# EAGLE board snesram (EAGLE 5.04), part 1 of 2
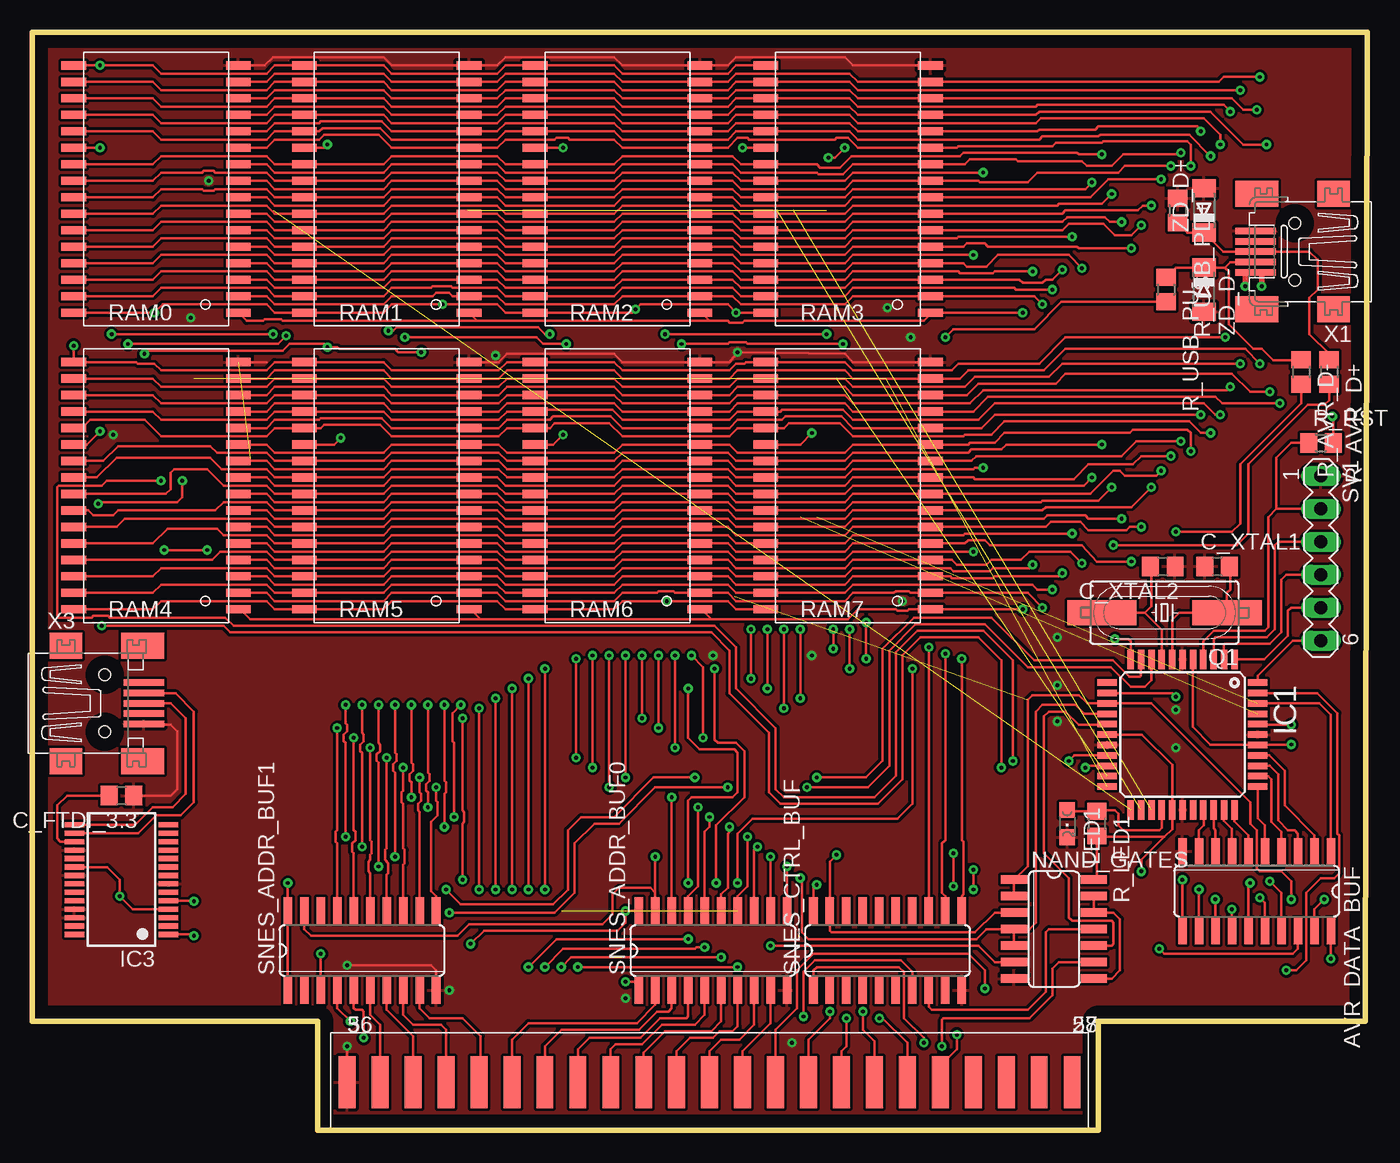
[diagram p2: board, top side]
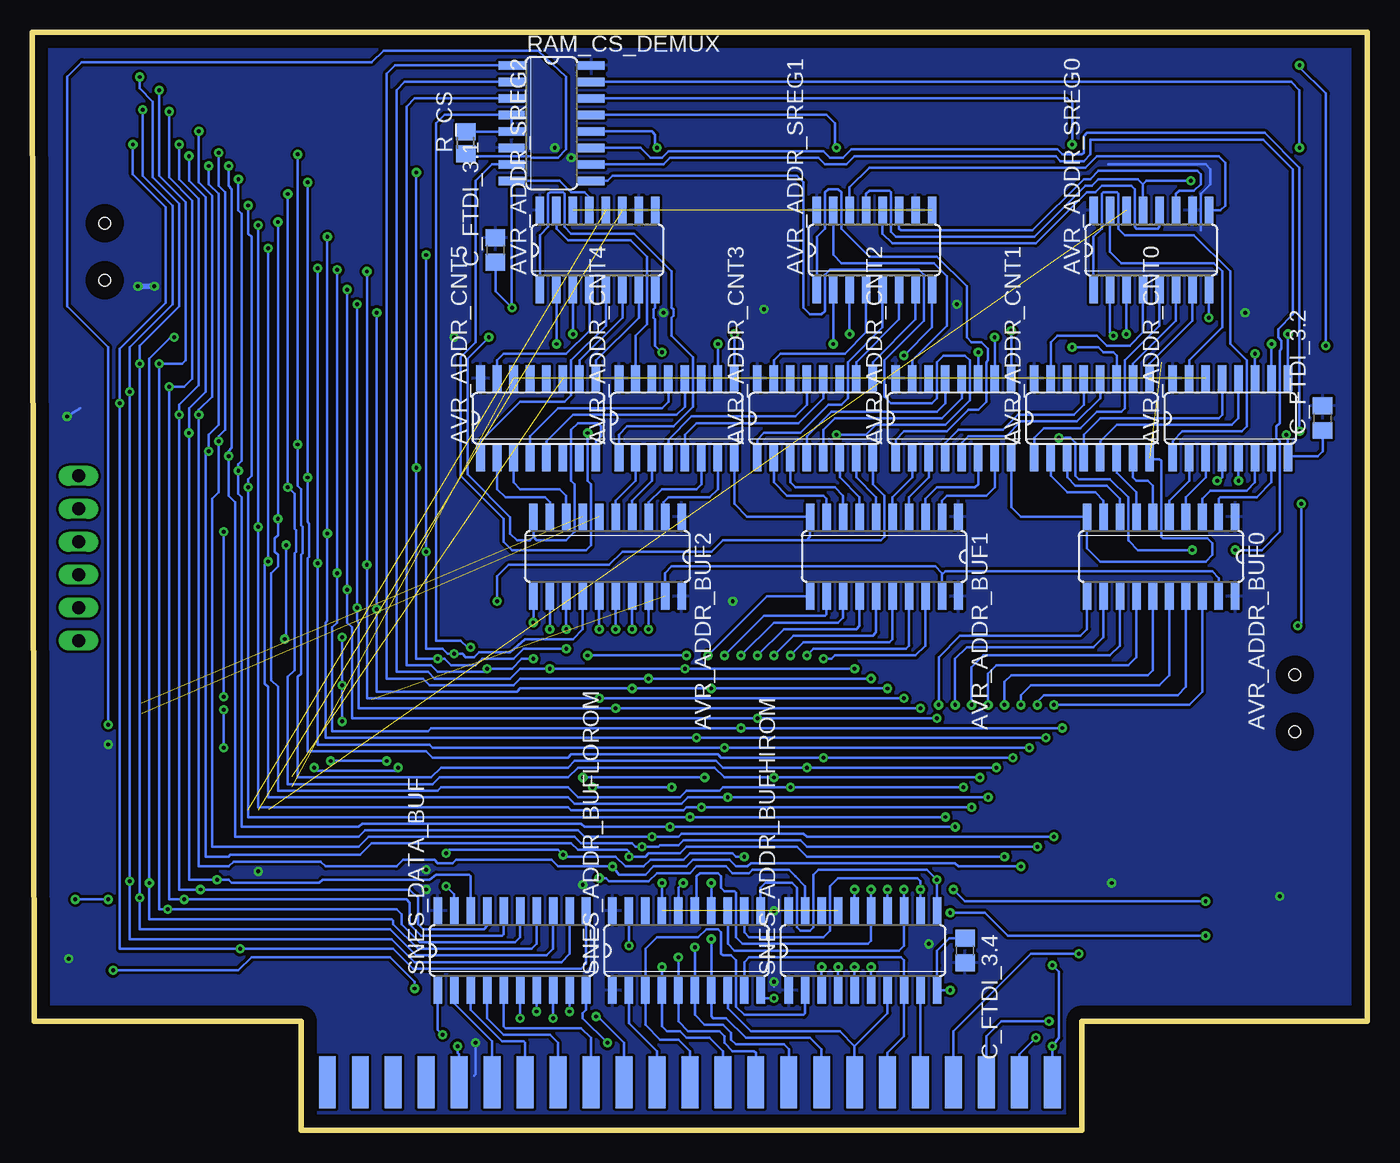
[diagram p3: board, bottom side, seen from below]

Size 102.87 x 84.58 mm. Coordinates in mm from the lower left corner, seen from the top.
Outline: 102.74,8.38 102.87,84.58 0,84.58 0,8.38 21.97,8.38 21.97,0 82.17,0 82.17,8.38 102.74,8.38
Copper layers (1*16): Top 0.035mm / dielectric 1.5mm / Bottom 0.035mm
Design rules "default *": minimum track width 0.2mm, minimum drill 0.3mm, track to track 8mil, track to pad 8mil, pad to pad 8mil, via to via 8mil, smd to smd 8mil, copper to edge 40mil, drill to drill 8mil, minimum pad ring 10mil, minimum via ring 8mil, stop-mask expansion 4mil, vias tented up to drill 0mil, thermal gap 10mil

## Footprints (pad centres in the part's own frame; a part is rotated, then mirrored left to right if it is on the bottom)
SO20 = smd 0.66 x 2.032: 1 -5.715,-3.073; 2 -4.445,-3.073; 3 -3.175,-3.073; 4 -1.905,-3.073; 5 -0.635,-3.073; 6 0.635,-3.073; 7 1.905,-3.073; 8 3.175,-3.073; 9 4.445,-3.073; 10 5.715,-3.073; 11 5.715,3.073; 12 4.445,3.073; 13 3.175,3.073; 14 1.905,3.073; 15 0.635,3.073; 16 -0.635,3.073; 17 -1.905,3.073; 18 -3.175,3.073; 19 -4.445,3.073; 20 -5.715,3.073
SO16 = smd 0.66 x 2.032: 1 -4.445,-3.073; 2 -3.175,-3.073; 3 -1.905,-3.073; 4 -0.635,-3.073; 5 0.635,-3.073; 6 1.905,-3.073; 7 3.175,-3.073; 8 4.445,-3.073; 9 4.445,3.073; 10 3.175,3.073; 11 1.905,3.073; 12 0.635,3.073; 13 -0.635,3.073; 14 -1.905,3.073; 15 -3.175,3.073; 16 -4.445,3.073
C0805 = smd 1.3 x 1.5: 1 -0.95,0; 2 0.95,0
TQFP44 = smd 1.5 x 0.5: 1 -5.8,4; 2 -5.8,3.2; 3 -5.8,2.4; 4 -5.8,1.6; 5 -5.8,0.8; 6 -5.8,0; 7 -5.8,-0.8; 8 -5.8,-1.6; 9 -5.8,-2.4; 10 -5.8,-3.2; 11 -5.8,-4; 23 5.8,-4; 24 5.8,-3.2; 25 5.8,-2.4; 26 5.8,-1.6; 27 5.8,-0.8; 28 5.8,0; 29 5.8,0.8; 30 5.8,1.6; 31 5.8,2.4; 32 5.8,3.2; 33 5.8,4 | smd 0.5 x 1.5: 12 -4,-5.8; 13 -3.2,-5.8; 14 -2.4,-5.8; 15 -1.6,-5.8; 16 -0.8,-5.8; 17 0,-5.8; 18 0.8,-5.8; 19 1.6,-5.8; 20 2.4,-5.8; 21 3.2,-5.8; 22 4,-5.8; 34 4,5.8; 35 3.2,5.8; 36 2.4,5.8; 37 1.6,5.8; 38 0.8,5.8; 39 0,5.8; 40 -0.8,5.8; 41 -1.6,5.8; 42 -2.4,5.8; 43 -3.2,5.8; 44 -4,5.8
SSOP28 = smd 0.4 x 1.5: 1 -4.225,-3.625; 2 -3.575,-3.625; 3 -2.925,-3.625; 4 -2.275,-3.625; 5 -1.625,-3.625; 6 -0.975,-3.625; 7 -0.325,-3.625; 8 0.325,-3.625; 9 0.975,-3.625; 10 1.625,-3.625; 11 2.275,-3.625; 12 2.925,-3.625; 13 3.575,-3.625; 14 4.225,-3.625; 15 4.225,3.625; 16 3.575,3.625; 17 2.925,3.625; 18 2.275,3.625; 19 1.625,3.625; 20 0.975,3.625; 21 0.325,3.625; 22 -0.325,3.625; 23 -0.975,3.625; 24 -1.625,3.625; 25 -2.275,3.625; 26 -2.925,3.625; 27 -3.575,3.625; 28 -4.225,3.625
CHIPLED_0805 = smd 1.2 x 1.2: A 0,-1.05; C 0,1.05
SO14 = smd 0.66 x 2.032: 1 -3.81,-3.073; 2 -2.54,-3.073; 3 -1.27,-3.073; 4 0,-3.073; 5 1.27,-3.073; 6 2.54,-3.073; 7 3.81,-3.073; 8 3.81,3.073; 9 2.54,3.073; 10 1.27,3.073; 11 0,3.073; 12 -1.27,3.073; 13 -2.54,3.073; 14 -3.81,3.073
HC49UP = smd 5.334 x 1.93: 1 -4.826,0; 2 4.826,0
R0805 = smd 1.3 x 1.5: 1 -0.95,0; 2 0.95,0
R0805' = smd 1.3 x 1.5: 1 -0.85,0; 2 0.85,0
SOP-32 = smd 1.905 x 0.635: 1 -6.35,9.525; 2 -6.35,8.255; 3 -6.35,6.985; 4 -6.35,5.715; 5 -6.35,4.445; 6 -6.35,3.175; 7 -6.35,1.905; 8 -6.35,0.635; 9 -6.35,-0.635; 10 -6.35,-1.905; 11 -6.35,-3.175; 12 -6.35,-4.445; 13 -6.35,-5.715; 14 -6.35,-6.985; 15 -6.35,-8.255; 16 -6.35,-9.525; 17 6.35,-9.525; 18 6.35,-8.255; 19 6.35,-6.985; 20 6.35,-5.715; 21 6.35,-4.445; 22 6.35,-3.175; 23 6.35,-1.905; 24 6.35,-0.635; 25 6.35,0.635; 26 6.35,1.905; 27 6.35,3.175; 28 6.35,4.445; 29 6.35,5.715; 30 6.35,6.985; 31 6.35,8.255; 32 6.35,9.525
MA06-1 = drill 1.016 long: 1 -6.35,0; 2 -3.81,0; 3 -1.27,0; 4 1.27,0; 5 3.81,0; 6 6.35,0
1X31_SNES_HEADER = smd 1.3 x 4: P5 -27.94,0; P6 -25.4,0; P7 -22.86,0; P8 -20.32,0; P9 -17.78,0; P10 -15.24,0; P11 -12.7,0; P12 -10.16,0; P13 -7.62,0; P14 -5.08,0; P15 -2.54,0; P16 0,0; P17 2.54,0; P18 5.08,0; P19 7.62,0; P20 10.16,0; P21 12.7,0; P22 15.24,0; P23 17.78,0; P24 20.32,0; P25 22.86,0; P26 25.4,0; P27 27.94,0
1X31_SNES_HEADERBACK = smd 1.3 x 4 bottom: 36 -27.94,0; 37 -25.4,0; 38 -22.86,0; 39 -20.32,0; 40 -17.78,0; 41 -15.24,0; 42 -12.7,0; 43 -10.16,0; 44 -7.62,0; 45 -5.08,0; 46 -2.54,0; 47 0,0; 48 2.54,0; 49 5.08,0; 50 7.62,0; 51 10.16,0; 52 12.7,0; 53 15.24,0; 54 17.78,0; 55 20.32,0; 56 22.86,0; 57 25.4,0; 58 27.94,0
32005-201 = smd 3.1 x 0.5: 1 3,1.6; 2 3,0.8; 3 3,0; 4 3,-0.8; 5 3,-1.6 | smd 2.5 x 2: M1 -3,-4.45; M2 -3,4.45 | smd 3.3 x 2: M3 2.9,4.45; M4 2.9,-4.45 | hole 0.9: 0,2.2; 0,-2.2
32005-301 = smd 3.1 x 0.5: 1 3,1.6; 2 3,0.8; 3 3,0; 4 3,-0.8; 5 3,-1.6 | smd 2.5 x 2: M1 -3,-4.45; M2 -3,4.45 | smd 3.3 x 2: M3 2.9,4.45; M4 2.9,-4.45 | hole 0.9: 0,2.2; 0,-2.2
MINIMELF = smd 1.4 x 1.8: A 1.7,0; C -1.7,0

## Placement (x,y rotation side)
AVR_ADDR_BUF0  74245  [SO20]  15.87,44.2 180 bottom
AVR_ADDR_BUF1  74245  [SO20]  37.21,44.2 180 bottom
AVR_ADDR_BUF2  74245  [SO20]  58.55,44.2 180 bottom
AVR_ADDR_CNT0  40193D  [SO16]  10.54,54.86 0 bottom
AVR_ADDR_CNT1  40193D  [SO16]  21.21,54.86 0 bottom
AVR_ADDR_CNT2  40193D  [SO16]  31.88,54.86 0 bottom
AVR_ADDR_CNT3  40193D  [SO16]  42.54,54.86 0 bottom
AVR_ADDR_CNT4  40193D  [SO16]  53.21,54.86 0 bottom
AVR_ADDR_CNT5  40193D  [SO16]  63.88,54.86 0 bottom
AVR_ADDR_SREG0  74HCT595D  [SO16]  16.64,67.82 0 bottom
AVR_ADDR_SREG1  74HCT595D  [SO16]  37.97,67.82 0 bottom
AVR_ADDR_SREG2  74HCT595D  [SO16]  59.31,67.82 0 bottom
AVR_DATA_BUF  74245  [SO20]  94.36,18.41 180 top
C_FTDI_3.1  100n  [C0805]  67.18,67.82 90 bottom
C_FTDI_3.2  100n  [C0805]  3.43,54.86 90 bottom
C_FTDI_3.3  100n  [C0805]  6.86,25.78 180 top
C_FTDI_3.4  100n  [C0805]  30.99,13.84 270 bottom
C_XTAL1  22p  [C0805]  91.31,43.43 0 top
C_XTAL2  22p  [C0805]  87.12,43.43 180 top
IC1  ATMEGA644A  [TQFP44]  88.65,30.48 270 top
IC3  FT232RL  [SSOP28]  6.86,19.3 90 top
LED1  [CHIPLED_0805]  79.76,23.62 180 top
NAND_GATES  74S00D  [SO14]  78.74,15.49 270 top
Q1  [HC49UP]  87.25,39.88 180 top
R_AVR_D+  68  [R0805]  99.95,58.42 270 top
R_AVR_D-  68  [R0805]  97.79,58.42 270 top
R_CS  200?!  [R0805']  69.47,76.07 90 bottom
R_LED1  1k6  [R0805]  82.04,23.62 270 top
R_RST  4k7  [R0805]  99.31,52.96 0 top
R_USB_PD+  1M  [R0805]  88.27,70.87 270 top
R_USB_PU-  1k5  [R0805]  87.38,64.77 270 top
RAM0  KM628512-XX  [SOP-32]  9.52,72.52 180 top
RAM1  KM628512-XX  [SOP-32]  27.3,72.52 180 top
RAM2  KM628512-XX  [SOP-32]  45.09,72.52 180 top
RAM3  KM628512-XX  [SOP-32]  62.86,72.52 180 top
RAM4  KM628512-XX  [SOP-32]  9.52,49.66 180 top
RAM5  KM628512-XX  [SOP-32]  27.3,49.66 180 top
RAM6  KM628512-XX  [SOP-32]  45.09,49.66 180 top
RAM7  KM628512-XX  [SOP-32]  62.86,49.66 180 top
RAM_CS_DEMUX  74LS138D  [SO16]  62.86,77.6 270 bottom
SNES_ADDR_BUF0  74245  [SO20]  52.45,13.84 0 top
SNES_ADDR_BUF1  74245  [SO20]  25.4,13.84 0 top
SNES_ADDR_BUFHIROM  74245  [SO20]  38.86,13.84 0 bottom
SNES_ADDR_BUFLOROM  74245  [SO20]  52.45,13.84 0 bottom
SNES_CTRL_BUF  74245  [SO20]  65.91,13.84 0 top
SNES_DATA_BUF  74245  [SO20]  65.91,13.84 0 bottom
SV1  [MA06-1]  99.31,44.07 270 top
U$1  SNES_CON_1  [1X31_SNES_HEADER]  52.2,3.68 0 top
U$2  SNES_CON_2  [1X31_SNES_HEADERBACK]  52.2,3.68 0 top
X1  MINI-USB  [32005-201]  97.28,67.69 180 top
X3  MINI-USB-32005-301  [32005-301]  5.59,32.89 0 top
ZD_D+  3.6V  [MINIMELF]  90.3,70.87 90 top
ZD_D-  3.6V  [MINIMELF]  90.3,64.77 270 top

## Tracks (layer width: path | path; a pad name or v marks a point on that pad's centre or on a via)
A0  (via drill 0.3, 0.3 pad 0.61)
  Top 0.203: RAM0.12 18.03,76.96 18.67,77.6 22.1,77.6 22.23,77.72 26.92,77.72 27.69,76.96 RAM1.12 35.81,76.96 36.45,77.6 44.83,77.6 45.47,76.96 RAM2.12 53.59,76.96 54.23,77.6 62.99,77.6 63.63,76.96 RAM3.12 77.47,76.96 77.6,77.09 81.92,77.09 82.17,77.34 89.79,77.34 90.04,77.09 v90.04,76.96 | RAM4.12 18.03,54.1 18.67,54.74 22.1,54.74 22.23,54.86 26.92,54.86 27.69,54.1 RAM5.12 35.94,54.1 36.58,54.74 39.88,54.74 40.13,54.99 44.58,54.99 45.47,54.1 RAM6.12 53.72,54.1 54.36,54.74 57.78,54.74 58.04,54.99 62.36,54.99 63.25,54.1 RAM7.12 73.15,54.1 74.17,55.12 v90.04,55.12 | v58.17,20.32 SNES_ADDR_BUF0.11 | v26.67,20.32 26.67,28.32 26.54,28.45 26.54,28.96 26.8,29.21 26.8,29.72 26.67,29.84 v26.67,32.77
  Bottom 0.2: 44.07,20.57 47.5,20.57 47.75,20.32 48.64,20.32 49.15,20.83 51.94,20.83 52.45,20.32 54.99,20.32
  Bottom 0.203: v90.04,76.96 90.04,73.03 89.03,72.01 89.03,56.52 90.04,55.5 v90.04,55.12 90.04,20.32 87.76,20.32 87.38,20.7 80.65,20.7 80.26,20.32 74.8,20.32 74.3,20.83 71.88,20.83 71.63,20.57 70.48,20.57 70.23,20.83 62.86,20.83 62.36,20.32 v58.17,20.32 57.66,19.68 55.63,19.68 54.99,20.32 | v26.67,20.32 31.5,20.32 31.75,20.57 44.07,20.57 | v26.67,32.77 26.67,33.53 25.91,34.29 16,34.29 15.24,35.05 AVR_ADDR_BUF0.16
A1  (via drill 0.3, 0.3 pad 0.61)
  Top 0.203: RAM0.11 18.03,75.69 18.67,76.33 22.1,76.33 22.48,76.71 26.67,76.71 27.69,75.69 RAM1.11 35.81,75.69 36.45,76.33 40.26,76.33 40.39,76.45 41.27,76.45 41.4,76.33 44.83,76.33 45.47,75.69 RAM2.11 53.59,75.69 54.36,76.45 55.12,76.45 55.24,76.33 61.85,76.33 61.98,76.45 62.86,76.45 63.63,75.69 RAM3.11 71.25,75.69 71.37,75.82 78.61,75.82 78.87,76.07 82.42,76.07 82.55,76.2 89.03,76.2 89.28,75.95 v89.28,74.3 | RAM4.11 18.03,52.83 18.67,52.2 27.05,52.2 27.69,52.83 RAM5.11 35.94,52.83 36.58,52.2 44.83,52.2 45.47,52.83 RAM6.11 53.72,52.83 54.36,52.2 62.61,52.2 63.25,52.83 RAM7.11 72.14,52.83 72.26,52.96 74.17,52.96 74.93,53.72 84.58,53.72 84.84,53.98 89.03,53.98 89.28,53.72 v89.28,52.32 | v56.9,21.08 SNES_ADDR_BUF0.12 | v27.94,21.08 27.94,27.56 27.81,27.69 27.81,28.19 28.07,28.45 28.07,28.96 27.94,29.08 v27.94,32.77
  Bottom 0.203: v89.28,74.3 89.28,72.9 88.52,72.14 88.52,54.36 89.28,53.59 v89.28,52.32 89.54,52.07 89.54,21.08 87.76,21.08 87.63,21.21 77.6,21.21 76.71,22.1 61.34,22.1 60.83,21.59 57.02,21.59 56.9,21.46 v56.9,21.08 55.63,21.08 55.37,21.34 52.96,21.34 52.45,21.84 43.94,21.84 43.18,21.08 v27.94,21.08 | v27.94,32.77 27.94,34.54 27.43,35.05 16.89,35.05 16.51,35.43 AVR_ADDR_BUF0.15
A2  (via drill 0.3, 0.3 pad 0.61)
  Top 0.203: RAM0.10 18.03,74.42 18.67,73.79 27.05,73.79 27.69,74.42 RAM1.10 35.81,74.42 36.45,73.79 44.83,73.79 45.47,74.42 RAM2.10 53.97,74.42 54.61,73.79 60.45,73.79 60.58,73.66 62.48,73.66 63.25,74.42 RAM3.10 71.88,74.42 72.26,74.8 75.82,74.8 75.95,74.68 80.9,74.68 81.28,74.3 83.19,74.3 84.07,75.18 88.39,75.18 v88.52,75.31 | RAM4.10 18.03,51.56 18.67,50.93 27.05,50.93 27.69,51.56 RAM5.10 35.94,51.56 36.58,50.93 44.83,50.93 45.47,51.56 RAM6.10 53.59,51.56 54.23,50.93 62.61,50.93 63.25,51.56 RAM7.10 72.39,51.56 72.77,51.94 83.95,51.94 85.09,53.09 v88.52,53.09 | SNES_ADDR_BUF0.13 55.63,21.59 v55.88,21.84 | v25.4,32.77 25.4,30.61 25.53,30.48 25.53,29.97 25.27,29.72 25.27,29.21 25.4,29.08 v25.4,21.84
  Bottom 0.203: v88.52,75.31 88.52,72.77 88.01,72.26 88.01,53.98 88.52,53.47 v88.52,53.09 88.52,49.15 89.03,48.64 89.03,21.84 77.72,21.84 76.96,22.61 61.09,22.61 60.58,22.1 56.64,22.1 56.39,21.84 v55.88,21.84 54.61,21.84 54.48,21.97 53.09,21.97 52.7,22.35 43.69,22.35 43.18,21.84 v25.4,21.84 | v25.4,32.77 25.4,33.02 24.89,33.53 14.6,33.53 13.97,34.16 AVR_ADDR_BUF0.17
A3  (via drill 0.3, 0.3 pad 0.61)
  Top 0.203: RAM0.9 18.03,73.15 18.67,72.52 27.05,72.52 27.69,73.15 RAM1.9 35.81,73.15 36.45,72.52 44.83,72.52 45.47,73.15 RAM2.9 53.97,73.15 54.61,72.52 62.61,72.52 63.25,73.15 RAM3.9 72.9,73.15 73.03,73.03 76.71,73.03 77.47,73.79 83.69,73.79 84.2,74.3 v87.76,74.3 | RAM4.9 18.03,50.29 18.67,49.66 27.05,49.66 27.69,50.29 RAM5.9 35.81,50.29 36.45,49.66 44.83,49.66 45.47,50.29 RAM6.9 53.59,50.29 54.23,49.66 62.61,49.66 63.25,50.29 RAM7.9 72.52,50.29 72.64,50.16 80.26,50.16 81.41,51.31 84.84,51.31 85.47,51.94 v87.76,51.94 | SNES_ADDR_BUF0.14 54.36,18.03 55.12,18.8 v55.12,22.61 | v24.13,22.61 24.13,29.84 24,29.97 24,30.48 24.26,30.73 24.26,31.24 24.13,31.37 v24.13,32.77
  Bottom 0.203: v87.76,74.3 87.76,72.77 87.5,72.52 87.5,52.58 87.76,52.32 v87.76,51.94 87.76,48.9 87.25,48.39 87.25,22.61 77.72,22.61 77.22,23.11 60.83,23.11 60.32,22.61 v55.12,22.61 53.09,22.61 52.83,22.86 43.43,22.86 43.18,22.61 v24.13,22.61 | v24.13,32.77 13.72,32.77 12.7,33.78 AVR_ADDR_BUF0.18
A4  (via drill 0.3, 0.3 pad 0.61)
  Top 0.203: RAM0.8 18.03,71.88 18.67,71.25 27.05,71.25 27.69,71.88 RAM1.8 35.81,71.88 36.45,71.25 44.83,71.25 45.47,71.88 RAM2.8 53.97,71.88 54.61,71.25 62.61,71.25 63.25,71.88 RAM3.8 80.9,71.88 | RAM4.8 18.03,49.02 18.67,48.39 27.05,48.39 27.69,49.02 RAM5.8 35.81,49.02 36.45,48.39 44.83,48.39 45.47,49.02 RAM6.8 53.59,49.02 54.23,48.39 62.61,48.39 63.25,49.02 RAM7.8 81.53,49.02 83.31,50.8 83.82,50.8 84.2,50.42 86.61,50.42 v87,50.8 | 80.9,71.88 81.03,71.88 | 80.9,71.88 81.53,71.88 82.93,73.28 v87,73.28 | SNES_ADDR_BUF0.15 53.09,18.16 53.59,18.67 53.59,22.86 53.72,22.99 v53.72,23.37 | v31.75,23.37 31.75,25.91 31.88,26.04 31.88,26.8 31.75,26.92 v31.75,32.77
  Bottom 0.203: v87,73.28 87,70.87 86.74,70.61 86.74,51.56 87,51.31 v87,50.8 87,49.02 86.74,48.77 86.74,23.37 77.72,23.37 77.47,23.62 60.58,23.62 60.32,23.37 v53.72,23.37 v31.75,23.37 | v31.75,32.77 31.75,36.32 30.86,37.21 21.08,37.21 20.32,37.97 AVR_ADDR_BUF0.12
A5  (via drill 0.3, 0.3 pad 0.61)
  Top 0.203: RAM0.7 18.03,70.61 18.67,69.98 27.05,69.98 27.69,70.61 RAM1.7 35.81,70.61 36.45,69.98 44.83,69.98 45.47,70.61 RAM2.7 53.97,70.61 54.61,69.98 62.61,69.98 63.25,70.61 RAM3.7 79.38,70.61 79.63,70.87 85.22,70.87 85.6,71.25 v86.23,71.25 | RAM4.7 18.03,47.75 18.67,47.12 27.05,47.12 27.69,47.75 RAM5.7 35.81,47.75 36.45,47.12 44.83,47.12 45.47,47.75 RAM6.7 53.59,47.75 54.23,47.12 62.61,47.12 63.25,47.75 RAM7.7 77.85,47.75 78.11,48.01 84.71,48.01 v86.23,49.53 | SNES_ADDR_BUF0.16 51.82,22.99 52.2,23.37 v52.2,24.13 | v33.02,32.77 32.38,32.13 32.38,29.97 32.51,29.84 v32.51,24.13
  Bottom 0.203: v86.23,71.25 86.23,69.09 85.98,68.83 85.98,50.42 86.23,50.16 v86.23,49.53 86.23,24.13 v52.2,24.13 v32.51,24.13 | AVR_ADDR_BUF0.11 21.59,38.61 22.1,38.1 31.37,38.1 33.02,36.45 v33.02,32.77
A6  (via drill 0.3, 0.3 pad 0.61)
  Top 0.203: RAM0.6 18.03,69.34 18.67,68.71 27.05,68.71 27.69,69.34 RAM1.6 35.81,69.34 36.45,68.71 44.83,68.71 45.47,69.34 RAM2.6 53.97,69.34 54.61,68.71 62.61,68.71 63.25,69.34 RAM3.6 79.38,69.34 79.88,69.85 82.55,69.85 83.44,68.96 84.71,68.96 v85.47,69.72 | RAM4.6 18.03,46.48 18.67,45.85 27.05,45.85 27.69,46.48 RAM5.6 35.81,46.48 36.45,45.85 44.83,45.85 45.47,46.48 RAM6.6 53.59,46.48 54.23,45.85 62.61,45.85 63.25,46.48 RAM7.6 78.11,46.48 78.49,46.86 80.77,46.86 81.41,46.23 84.33,46.23 84.58,46.48 v85.47,46.48 | SNES_ADDR_BUF0.17 50.55,18.03 51.31,18.8 v51.31,24.89 | v30.48,24.89 30.48,26.04 30.35,26.16 30.35,26.67 30.61,26.92 30.61,27.43 30.48,27.56 v30.48,32.77
  Bottom 0.203: v85.47,69.72 v85.47,46.48 85.47,24.89 61.59,24.89 61.34,24.64 52.7,24.64 52.45,24.89 v51.31,24.89 v30.48,24.89 | v30.48,32.77 30.48,35.69 29.59,36.58 19.81,36.58 19.05,37.34 AVR_ADDR_BUF0.13
A7  (via drill 0.3, 0.3 pad 0.61)
  Top 0.203: RAM0.5 18.03,68.07 18.67,67.44 27.05,67.44 27.69,68.07 RAM1.5 35.81,68.07 36.45,67.44 44.83,67.44 45.47,68.07 RAM2.5 53.97,68.07 54.61,67.44 62.61,67.44 63.25,68.07 RAM3.5 71.76,68.07 72.01,68.33 73.41,68.33 73.66,68.07 80.52,68.07 80.65,67.95 v84.71,67.95 | RAM4.5 18.03,45.21 18.67,44.58 27.05,44.58 27.69,45.21 RAM5.5 35.81,45.21 36.45,44.58 44.83,44.58 45.47,45.21 RAM6.5 53.59,45.21 54.23,44.58 62.61,44.58 63.25,45.21 RAM7.5 71.88,45.21 72.14,45.47 73.41,45.47 73.79,45.09 80.9,45.09 82.04,43.81 v84.71,43.81 | v49.28,25.65 SNES_ADDR_BUF0.18 | v29.21,25.65 29.21,26.8 29.08,26.92 29.08,27.43 29.34,27.69 29.34,28.19 29.21,28.32 v29.21,32.77
  Bottom 0.203: v84.71,67.95 v84.71,43.81 84.96,43.56 84.96,34.42 84.71,34.16 84.71,25.65 61.59,25.65 61.09,25.15 52.83,25.15 52.32,25.65 v49.28,25.65 v29.21,25.65 | v29.21,32.77 29.21,35.18 28.58,35.81 18.42,35.81 17.78,36.45 AVR_ADDR_BUF0.14
A8  (via drill 0.3, 0.3 pad 0.61)
  Top 0.203: RAM0.27 9.27,69.34 9.91,69.98 18.03,69.98 18.67,69.34 RAM1.27 27.05,69.34 27.69,69.98 35.81,69.98 36.45,69.34 RAM2.27 44.83,69.34 45.47,69.98 53.97,69.98 54.61,69.34 RAM3.27 62.61,69.34 63.25,69.98 79.38,69.98 79.76,70.36 82.68,70.36 83.06,69.98 v83.95,69.98 | RAM4.27 6.48,46.48 7.11,47.12 18.03,47.12 18.67,46.48 RAM5.27 27.05,46.48 27.69,47.12 35.81,47.12 36.45,46.48 RAM6.27 44.83,46.48 45.47,47.12 53.59,47.12 54.23,46.48 RAM7.27 62.61,46.48 63.25,47.12 77.98,47.12 78.23,47.37 81.15,47.37 81.41,47.12 v83.95,47.12 | SNES_ADDR_BUF1.11 31.12,18.03 30.73,18.41 30.73,23.75 31.24,24.26 31.24,25.27 31.12,25.4 v31.12,26.42 | v44.45,26.42 v44.45,36.58
  Bottom 0.203: v83.95,69.98 v83.95,47.12 83.95,45.85 84.2,45.59 84.2,44.58 83.95,44.32 83.95,43.43 84.45,42.93 84.45,34.67 83.95,34.16 83.95,26.16 71.63,26.16 71.37,26.42 61.59,26.42 60.83,25.65 52.96,25.65 52.45,26.16 49.91,26.16 49.66,26.42 v44.45,26.42 v31.12,26.42 | AVR_ADDR_BUF1.16 36.58,37.85 36.83,37.59 43.43,37.59 v44.45,36.58
A9  (via drill 0.3, 0.3 pad 0.61)
  Top 0.203: RAM0.26 9.27,70.61 9.91,71.25 18.03,71.25 18.67,70.61 RAM1.26 27.05,70.61 27.69,71.25 35.81,71.25 36.45,70.61 RAM2.26 44.83,70.61 45.47,71.25 53.97,71.25 54.61,70.61 RAM3.26 62.61,70.61 63.25,71.25 78.99,71.25 79.12,71.37 82.42,71.37 v83.19,72.14 | RAM4.26 4.32,47.75 4.7,47.37 6.22,47.37 6.6,47.75 14.1,47.75 14.73,48.39 18.03,48.39 18.67,47.75 RAM5.26 27.05,47.75 27.69,48.39 35.81,48.39 36.45,47.75 RAM6.26 44.83,47.75 45.47,48.39 53.59,48.39 54.23,47.75 RAM7.26 62.61,47.75 63.25,48.39 77.72,48.39 77.85,48.51 82.17,48.51 v83.19,49.53 | SNES_ADDR_BUF1.12 29.85,24.51 29.72,24.64 29.72,25.15 29.97,25.4 29.97,25.91 29.85,26.04 v29.85,27.18 | v45.72,27.18 v45.72,36.58
  Bottom 0.203: v83.19,72.14 v83.19,49.53 82.68,49.02 82.68,46.36 82.55,46.23 82.55,44.58 82.68,44.45 82.68,35.43 83.19,34.92 83.19,26.67 72.01,26.67 71.5,27.18 61.59,27.18 60.83,27.94 50.29,27.94 49.53,27.18 v45.72,27.18 v29.85,27.18 | AVR_ADDR_BUF1.15 37.85,38.35 38.1,38.1 44.2,38.1 v45.72,36.58
A10  (via drill 0.3, 0.3 pad 0.61)
  Top 0.203: RAM0.23 9.27,74.42 9.91,75.06 18.03,75.06 18.67,74.42 RAM1.23 27.05,74.42 27.69,75.06 35.81,75.06 36.45,74.42 RAM2.23 44.83,74.42 45.47,75.06 53.97,75.06 54.61,74.42 RAM3.23 60.45,74.42 60.71,74.17 62.23,74.17 63.12,75.06 71.5,75.06 71.76,75.31 80.52,75.31 80.65,75.18 v82.42,75.18 | RAM4.23 5.46,51.56 6.6,52.7 13.72,52.7 14.22,52.2 18.03,52.2 18.67,51.56 RAM5.23 27.05,51.56 27.69,52.2 35.94,52.2 36.58,51.56 RAM6.23 44.83,51.56 45.47,52.2 53.59,52.2 54.23,51.56 RAM7.23 62.61,51.56 63.25,52.2 72.14,52.2 72.39,52.45 74.68,52.45 75.06,52.83 v82.42,52.83 | SNES_ADDR_BUF1.13 28.58,20.45 28.7,20.57 28.7,21.59 28.58,21.72 28.58,25.15 28.45,25.27 28.45,26.04 28.58,26.16 v28.58,27.94 | v43.18,27.94 v43.18,36.58
  Bottom 0.203: v82.42,75.18 v82.42,52.83 82.42,49.66 82.17,49.4 82.17,46.61 82.04,46.48 82.04,44.45 82.17,44.32 82.17,35.18 82.42,34.92 82.42,27.18 72.14,27.18 71.37,27.94 61.59,27.94 61.09,28.45 50.16,28.45 49.66,27.94 v43.18,27.94 v28.58,27.94 | AVR_ADDR_BUF1.17 35.31,37.34 35.56,37.08 42.67,37.08 v43.18,36.58
A11  (via drill 0.3, 0.3 pad 0.61)
  Top 0.203: RAM0.25 9.27,71.88 9.91,72.52 13.08,72.52 13.21,72.39 13.97,72.39 14.1,72.52 18.03,72.52 18.67,71.88 RAM1.25 27.05,71.88 27.69,72.52 35.81,72.52 36.45,71.88 RAM2.25 44.83,71.88 45.47,72.52 53.97,72.52 54.61,71.88 RAM3.25 62.61,71.88 63.25,72.52 81.15,72.52 v81.66,73.03 | v81.66,50.29 81.03,49.66 63.25,49.66 62.61,49.02 RAM7.25 54.23,49.02 53.59,49.66 45.47,49.66 44.83,49.02 RAM6.25 36.45,49.02 35.81,49.66 27.69,49.66 27.05,49.02 RAM5.25 18.67,49.02 18.03,49.66 14.73,49.66 13.46,50.93 10.92,50.93 10.67,50.67 10.67,49.4 10.29,49.02 RAM4.25 | SNES_ADDR_BUF1.14 27.3,19.68 27.43,19.81 27.43,20.57 27.18,20.83 27.18,21.59 27.3,21.72 v27.3,28.7 | v41.91,28.7 v41.91,36.32
  Bottom 0.203: v81.66,73.03 v81.66,50.29 81.66,46.86 81.53,46.74 81.53,44.2 81.66,44.07 81.66,29.21 72.52,29.21 72.01,28.7 61.59,28.7 61.34,28.96 50.04,28.96 49.78,28.7 v41.91,28.7 v27.3,28.7 | v41.91,36.32 41.27,36.32 41.02,36.58 34.8,36.58 34.04,37.34 AVR_ADDR_BUF1.18
A12  (via drill 0.3, 0.3 pad 0.61)
  Top 0.203: RAM0.4 18.03,66.8 18.67,66.17 27.05,66.17 27.69,66.8 RAM1.4 35.81,66.8 36.45,66.17 44.83,66.17 45.47,66.8 RAM2.4 53.97,66.8 54.61,66.17 62.61,66.17 63.25,66.8 RAM3.4 71.76,66.8 72.01,66.55 73.53,66.55 74.42,67.44 79.88,67.44 v80.9,66.42 | RAM4.4 18.03,43.94 18.67,43.31 27.05,43.31 27.69,43.94 RAM5.4 35.81,43.94 36.45,43.31 44.83,43.31 45.47,43.94 RAM6.4 53.59,43.94 54.23,43.31 62.61,43.31 63.25,43.94 RAM7.4 70.87,43.94 71.25,43.56 73.53,43.56 73.91,43.94 76.2,43.94 76.84,44.58 80.01,44.58 v80.9,43.69 | SNES_ADDR_BUF1.15 26.04,19.81 25.91,19.94 25.91,20.7 26.04,20.83 26.04,21.21 26.16,21.34 26.16,22.23 26.04,22.35 v26.04,29.46 | v49.53,29.46 v49.53,36.58
  Bottom 0.203: v80.9,66.42 v80.9,43.69 80.9,29.72 72.26,29.72 72.01,29.46 v49.53,29.46 v26.04,29.46 | AVR_ADDR_BUF1.12 41.66,39.75 41.78,39.62 46.48,39.62 v49.53,36.58
A13  (via drill 0.3, 0.3 pad 0.61)
  Top 0.203: RAM0.28 9.27,68.07 9.91,68.71 18.03,68.71 18.67,68.07 RAM1.28 27.05,68.07 27.69,68.71 35.81,68.71 36.45,68.07 RAM2.28 44.83,68.07 45.47,68.71 53.97,68.71 54.61,68.07 RAM3.28 62.61,68.07 63.25,68.71 70.48,68.71 | RAM4.28 9.27,45.21 10.41,46.36 14.22,46.36 14.73,45.85 18.03,45.85 18.67,45.21 RAM5.28 27.05,45.21 27.69,45.85 35.81,45.85 36.45,45.21 RAM6.28 44.83,45.21 45.47,45.85 53.59,45.85 54.23,45.21 RAM7.28 62.61,45.21 63.25,45.85 71.76,45.85 71.88,45.97 v80.14,45.97 | 70.48,68.71 70.61,68.71 | 70.48,68.71 71.25,68.71 71.37,68.83 v80.14,68.83 | SNES_ADDR_BUF1.16 24.77,21.34 24.64,21.46 24.64,22.1 24.89,22.35 24.89,22.99 24.77,23.11 v24.77,30.23 | v50.8,36.58 51.69,35.69 v51.69,30.23
  Bottom 0.203: v80.14,68.83 v80.14,45.97 80.14,39.24 80.26,39.12 80.26,30.23 v51.69,30.23 v24.77,30.23 | AVR_ADDR_BUF1.11 46.25,41.12 v50.8,36.58
A14  (via drill 0.3, 0.3 pad 0.61)
  Top 0.203: RAM0.3 18.03,65.53 18.67,64.9 27.05,64.9 27.69,65.53 RAM1.3 35.81,65.53 36.45,64.9 44.83,64.9 45.47,65.53 RAM2.3 53.97,65.53 54.61,64.9 62.61,64.9 63.25,65.53 RAM3.3 76.07,65.53 76.33,65.28 77.85,65.28 78.11,65.53 78.61,65.53 v79.38,66.29 | RAM4.3 18.03,42.67 18.67,42.04 27.05,42.04 27.69,42.67 RAM5.3 35.81,42.67 36.45,42.04 44.83,42.04 45.47,42.67 RAM6.3 53.59,42.67 54.23,42.04 62.61,42.04 63.25,42.67 RAM7.3 70.74,42.67 70.87,42.55 74.04,42.55 74.17,42.67 79.12,42.67 v79.38,42.93 | SNES_ADDR_BUF1.17 23.5,22.1 23.37,22.23 23.37,22.99 23.5,23.11 v23.5,30.99 | v48.26,30.99 v48.26,36.58
  Bottom 0.203: v79.38,66.29 v79.38,42.93 79.38,39.12 79.76,38.73 79.76,30.73 72.39,30.73 72.14,30.99 v48.26,30.99 v23.5,30.99 | AVR_ADDR_BUF1.13 40.39,39.5 40.77,39.12 45.72,39.12 v48.26,36.58
A15  (via drill 0.3, 0.3 pad 0.61)
  Top 0.203: RAM0.31 9.27,64.26 9.91,64.9 18.03,64.9 18.67,64.26 RAM1.31 27.05,64.26 27.69,64.9 30.73,64.9 30.86,65.02 32.26,65.02 32.38,64.9 35.81,64.9 36.45,64.26 RAM2.31 44.83,64.26 45.47,64.9 53.97,64.9 54.61,64.26 RAM3.31 62.61,64.26 63.25,64.9 75.69,64.9 75.82,64.77 v78.61,64.77 | RAM4.31 9.27,41.4 9.91,42.04 18.03,42.04 18.67,41.4 RAM5.31 27.05,41.4 27.69,42.04 35.81,42.04 36.45,41.4 RAM6.31 44.83,41.4 45.47,42.04 53.59,42.04 54.23,41.4 RAM7.31 62.61,41.4 63.25,42.04 77.09,42.04 77.47,41.66 v78.61,41.66 | v33.15,31.75 33.15,24.64 33.27,24.51 33.27,23.75 33.15,23.62 v33.15,19.3 | v46.99,31.75 v46.99,36.58
  Bottom 0.203: v78.61,64.77 v78.61,41.66 78.61,39.12 78.23,38.73 78.23,31.75 v46.99,31.75 v33.15,31.75 | SNES_ADDR_BUFHIROM.11 v33.15,19.3 33.91,20.07 42.29,20.07 42.67,19.68 42.67,15.62 42.93,15.37 43.69,15.37 43.94,15.62 43.94,18.67 44.32,19.05 46.35,19.05 46.74,18.67 SNES_ADDR_BUFLOROM.11 | AVR_ADDR_BUF1.14 39.12,38.86 39.37,38.61 44.96,38.61 v46.99,36.58
A16  (via drill 0.3, 0.3 pad 0.61)
  Top 0.203: RAM0.2 18.03,64.26 18.67,63.63 27.05,63.63 27.69,64.26 30.86,64.26 31.12,64.52 32.13,64.52 32.38,64.26 RAM1.2 35.81,64.26 36.45,63.63 44.83,63.63 45.47,64.26 RAM2.2 53.97,64.26 54.61,63.63 62.61,63.63 63.25,64.26 RAM3.2 77.22,64.26 v77.85,63.63 | RAM4.2 18.03,41.4 18.67,40.77 27.05,40.77 27.69,41.4 RAM5.2 35.81,41.4 36.45,40.77 44.83,40.77 45.47,41.4 48.13,41.4 48.26,41.53 49.4,41.53 49.53,41.4 RAM6.2 53.59,41.4 54.23,40.77 62.61,40.77 63.25,41.4 66.42,41.4 66.55,41.53 67.56,41.53 67.69,41.4 RAM7.2 76.71,41.4 v77.85,40.26 | v34.42,18.54 v34.42,32.51 | v57.91,32.51 v57.91,38.61
  Bottom 0.2: 41.4,15.37 41.91,14.86 47.62,14.86 48.01,15.24 SNES_ADDR_BUFLOROM.12
  Bottom 0.203: v77.85,63.63 v77.85,40.26 77.85,39.24 77.72,39.12 77.72,32.51 v57.91,32.51 v34.42,32.51 | v34.42,18.54 SNES_ADDR_BUFHIROM.12 34.42,19.18 34.67,19.43 40.77,19.43 41.4,18.8 41.4,15.37 | v57.91,38.61 AVR_ADDR_BUF2.16
A17  (via drill 0.3, 0.3 pad 0.61)
  Top 0.203: RAM0.30 9.27,65.53 9.91,66.17 18.03,66.17 18.67,65.53 RAM1.30 27.05,65.53 27.69,66.17 35.81,66.17 36.45,65.53 RAM2.30 44.83,65.53 45.47,66.17 53.97,66.17 54.61,65.53 RAM3.30 62.61,65.53 63.25,66.17 66.29,66.17 | RAM4.30 9.27,42.67 9.91,43.31 18.03,43.31 18.67,42.67 RAM5.30 27.05,42.67 27.69,43.31 35.81,43.31 36.45,42.67 RAM6.30 44.83,42.67 45.47,43.31 53.59,43.31 54.23,42.67 RAM7.30 62.61,42.67 63.25,43.31 70.74,43.31 70.99,43.05 73.79,43.05 74.04,43.31 76.84,43.31 v77.09,43.56 | 66.29,66.17 66.42,66.17 | v77.09,66.17 74.17,66.17 74.04,66.04 71.5,66.04 71.37,66.17 66.29,66.17 | v35.69,33.27 v35.69,18.54 | v59.18,33.27 v59.18,38.61
  Bottom 0.2: 35.69,15.49 35.69,14.22 36.07,13.84 41.53,13.84
  Bottom 0.203: v77.09,66.17 v77.09,43.56 77.09,33.27 v59.18,33.27 v35.69,33.27 | v35.69,18.54 SNES_ADDR_BUFHIROM.13 35.69,15.49 | v59.18,38.61 AVR_ADDR_BUF2.15 | 41.53,13.84 48.77,13.84 49.28,14.35 SNES_ADDR_BUFLOROM.13
A18  (via drill 0.3, 0.3 pad 0.61)
  Top 0.203: 34.29,62.36 19.3,62.36 19.18,62.48 17.91,62.48 17.78,62.36 16.51,62.36 RAM0.1 | 34.29,62.36 RAM1.1 | 52.2,62.36 34.29,62.36 | RAM2.1 51.56,62.99 52.2,62.36 | 52.2,62.36 53.59,62.36 53.72,62.23 54.74,62.23 54.86,62.36 68.71,62.36 69.22,62.87 RAM3.1 v76.33,62.99 | RAM4.1 16,40.13 16.76,39.37 34.54,39.37 | 52.32,39.37 34.54,39.37 | 52.32,39.37 62.86,39.37 63.63,40.13 66.55,40.13 66.68,40.01 67.44,40.01 67.56,40.13 RAM7.1 v76.33,40.13 | RAM6.1 51.56,40.13 52.32,39.37 | RAM5.1 33.78,40.13 34.54,39.37 | v36.96,18.54 v36.96,34.04 | v56.64,34.04 v56.64,38.61 | v50.55,34.04 50.55,30.23 51.43,29.34 54.1,29.34 54.36,29.08 54.36,26.04 53.97,25.65 50.8,25.65 50.55,25.4 v50.55,19.05
  Bottom 0.203: v76.33,62.99 v76.33,40.13 76.33,33.78 65.53,33.78 65.28,34.04 v56.64,34.04 v50.55,34.04 v36.96,34.04 | SNES_ADDR_BUFHIROM.14 v36.96,18.54 | v50.55,19.05 SNES_ADDR_BUFLOROM.14 | v56.64,38.61 AVR_ADDR_BUF2.17
A19  (via drill 0.3, 0.3 pad 0.61)
  Top 0.203: v38.23,18.54 v38.23,34.8 | v55.37,34.8 v55.37,38.61
  Bottom 0.2: SNES_ADDR_BUFHIROM.15 38.23,14.61 38.48,14.35 48.13,14.35 48.64,14.86 48.64,18.29 48.77,18.41 49.53,18.41 49.78,18.67 49.78,19.56 50.04,19.81 51.43,19.81 51.69,19.56 51.69,17.04 SNES_ADDR_BUFLOROM.15
  Bottom 0.203: RAM_CS_DEMUX.1 74.93,82.04 75.56,81.41 75.56,34.8 72.77,34.8 72.26,34.29 65.79,34.29 65.28,34.8 v55.37,34.8 v38.23,34.8 | SNES_ADDR_BUFHIROM.15 v38.23,18.54 | v55.37,38.61 AVR_ADDR_BUF2.18
A20  (via drill 0.3, 0.3 pad 0.61)
  Top 0.203: v39.5,18.54 v39.5,35.56 | v62.99,35.56 v62.99,38.61 | v52.7,19.05 52.7,23.5 54.86,25.65 54.86,29.21 54.23,29.84 52.83,29.84 52.58,30.1 v52.58,35.56
  Bottom 0.203: RAM_CS_DEMUX.2 74.17,80.77 74.8,80.14 74.8,35.31 72.39,35.31 71.88,34.8 66.04,34.8 65.28,35.56 v62.99,35.56 v52.58,35.56 v39.5,35.56 | SNES_ADDR_BUFHIROM.16 v39.5,18.54 | v62.99,38.61 AVR_ADDR_BUF2.12 | SNES_ADDR_BUFLOROM.16 53.09,18.67 v52.7,19.05
A21  (via drill 0.3, 0.3 pad 0.61)  (1 unrouted)
  Top 0.203: v64.26,36.32 v64.26,39.12 | v54.36,19.05 54.36,22.86 55.5,24 66.68,24 67.82,25.15 v67.82,35.56
  Bottom 0.203: RAM_CS_DEMUX.3 73.41,79.5 74.04,78.87 74.04,35.81 72.14,35.81 71.63,35.31 68.07,35.31 v67.82,35.56 65.91,35.56 65.15,36.32 v64.26,36.32 | SNES_ADDR_BUFLOROM.17 v54.36,19.05 | AVR_ADDR_BUF2.11 v64.26,39.12
AVR/SNES_SW  (via drill 0.3)  (1 unrouted)
  Top 0.203: NAND_GATES.2 NAND_GATES.1 76.71,20.34 76.71,33.15 77.09,33.53 80.65,33.53 81.29,32.88 IC1.14 86.25,32.88 93.85,25.27 93.85,23.62 94.36,23.11 94.36,20.19 94.62,19.94 96.27,19.94 97.03,19.18 v97.03,17.78 | v99.57,17.78 98.81,17.02 AVR_DATA_BUF.19
  Bottom 0.203: v97.03,17.78 v99.57,17.78 | AVR_ADDR_BUF2.19 54.1,42.93 53.59,43.43 33.27,43.43 32.77,42.93 AVR_ADDR_BUF1.19 32.77,42.8 32.51,43.05 11.94,43.05 11.43,42.55 AVR_ADDR_BUF0.19
AVR/SNES_SW_INV  (via drill 0.3)
  Top 0.203: NAND_GATES.3 74.17,16.76 72.64,15.24 61.59,15.24 61.47,15.37 SNES_CTRL_BUF.19 61.47,20.7 v61.98,21.21 | SNES_ADDR_BUF1.19 20.96,15.49 21.46,14.99 32.77,14.99 33.65,15.88 43.94,15.88 44.7,16.64 44.7,18.16 45.21,18.67 47.62,18.67 48.01,18.29 SNES_ADDR_BUF0.19 v48.01,21.08 | v70.99,21.34 v70.99,18.8
  Bottom 0.2: 48.39,21.08 48.64,21.08 48.89,21.34 52.2,21.34 52.7,20.83 55.24,20.83
  Bottom 0.203: SNES_DATA_BUF.19 70.36,18.16 v70.99,18.8 | v70.99,21.34 70.74,21.59 62.36,21.59 v61.98,21.21 61.85,21.08 57.91,21.08 57.15,20.32 55.75,20.32 55.24,20.83 | v48.01,21.08 48.39,21.08
AVR_ADDR_CLR  (6 unrouted)
AVR_ADDR_DWN  (via drill 0.3)
  Top 0.203: IC1.20 81.29,28.08 v81.15,27.94 | v74.68,27.94 74.68,36.2 72.9,37.97 68.45,37.97 67.06,36.58 67.06,27.05 65.15,25.15 57.66,25.15 56.77,26.04 56.77,30.61 53.72,33.66 53.72,36.96 52.32,38.35 15.24,38.35 14.73,38.86 v5.33,38.86 | v11.56,50.04 11.56,48.77 11.18,48.39 5.21,48.39 v5.08,48.26
  Bottom 0.203: v74.68,27.94 74.68,27.81 74.8,27.69 80.9,27.69 v81.15,27.94 | v11.56,50.04 11.43,50.04 11.18,50.29 AVR_ADDR_CNT0.4 | v5.08,48.26 5.08,39.12 v5.33,38.86
AVR_ADDR_LATCH  (2 unrouted)
  Bottom 0.2: AVR_ADDR_SREG0.12 16,69.6
  Bottom 0.203: 16,69.6 16.13,69.47 17.78,69.47 17.91,69.6 17.91,72.52 18.16,72.77 20.45,72.77 20.96,72.26 21.59,72.26 25.53,68.33 36.58,68.33 37.34,69.09 AVR_ADDR_SREG1.12
AVR_ADDR_LOAD  (via drill 0.3)  (4 unrouted)
  Top 0.2: v22.73,60.33 23.5,60.33 23.62,60.2 27.94,60.2 28.19,59.94 v29.97,59.94
  Top 0.203: v8.64,59.82 8.89,60.07 19.3,60.07 19.81,60.58 22.48,60.58 v22.73,60.33
  Bottom 0.2: v29.97,59.94 AVR_ADDR_CNT2.11
  Bottom 0.203: AVR_ADDR_CNT0.11 v8.64,59.82 | v22.73,60.33 20.7,60.33 20.32,59.94 19.56,59.94 19.3,59.69 AVR_ADDR_CNT1.11
AVR_ADDR_SCK  (2 unrouted)
  Bottom 0.2: 36.07,69.47 AVR_ADDR_SREG1.11 | 20.57,73.91 20.7,73.91 21.34,73.28 21.84,73.28 25.78,69.34
  Bottom 0.203: AVR_ADDR_SREG0.11 14.73,72.14 14.48,72.39 13.33,72.39 12.83,72.9 12.83,73.66 13.08,73.91 20.57,73.91 | 25.78,69.34 35.94,69.34 36.07,69.47
AVR_ADDR_SER  (1 unrouted)
AVR_ADDR_UP  (via drill 0.3)
  Top 0.203: IC1.19 80.31,28.88 v79.88,28.45 | v75.56,28.45 75.56,36.2 73.28,38.48 68.2,38.48 66.55,36.83 66.55,27.3 64.9,25.65 57.91,25.65 57.28,26.29 57.28,30.99 54.23,34.04 54.23,37.21 52.58,38.86 15.49,38.86 14.86,39.5 5.97,39.5 5.84,39.62 4.7,39.62 4.57,39.5 2.03,39.5 1.91,39.62 1.91,49.53 2.03,49.66 5.33,49.66 5.71,50.04 v9.91,50.04
  Bottom 0.203: v75.56,28.45 v79.88,28.45 | v9.91,50.04 AVR_ADDR_CNT0.5
AVR_CS/  (via drill 0.3)
  Top 0.203: IC1.40 94.48,31.24 v97.03,31.24
  Bottom 0.203: v97.03,31.24 97.03,60.33 100.2,63.5 100.2,81.15 99.06,82.3 76.71,82.3 75.82,83.19 63.88,83.19 61.72,81.15 61.72,75.56 62.36,74.93 64.39,74.93 64.52,75.06 69.3,75.06 R_CS.1
AVR_D0
  Top 0.203: IC1.37 95.33,28.88 96.52,27.69 96.52,25.02 98.81,22.73 AVR_DATA_BUF.2
AVR_D1
  Top 0.203: IC1.36 95.36,28.08 96.01,27.43 96.01,23.88 96.77,23.11 97.28,23.11 97.54,22.86 AVR_DATA_BUF.3
AVR_D2
  Top 0.203: IC1.35 95.28,27.28 95.5,27.05 95.5,23.75 96.27,22.99 AVR_DATA_BUF.4
AVR_D3
  Top 0.203: IC1.34 94.45,24.05 95,23.5 AVR_DATA_BUF.5
AVR_D4
  Top 0.203: AVR_DATA_BUF.6 93.73,22.73 92.65,23.81 IC1.33
AVR_D5
  Top 0.203: AVR_DATA_BUF.7 92.46,23.24 91.85,23.85 IC1.32
AVR_D6
  Top 0.203: AVR_DATA_BUF.8 91.19,23.11 91.05,23.25 IC1.31
AVR_D7
  Top 0.203: IC1.30 90.3,24.63 90.3,23.5 89.92,23.11 AVR_DATA_BUF.9
AVR_D+
  Top 0.203: R_USB_PD+.2 89.02,69.17 ZD_D+.C 91.77,67.69 X1.3 98.43,67.69 99.06,67.06 99.06,64.77 98.43,64.13 98.43,61.34 99.95,59.82 R_AVR_D+.1
AVR_D-
  Top 0.203: ZD_D-.C 90.84,67.02 | R_AVR_D-.1 97.73,59.31 95.63,59.31 94.74,60.2 94.11,60.2 92.2,62.1 92.2,66.17 91.9,66.47 | ZD_D-.C 91.9,66.47 | R_USB_PU-.1 88.13,66.47 ZD_D-.C | X1.2 92.32,66.89 91.9,66.47
AVR_RD/  (1 unrouted)
  Top 0.203: IC1.42 99.2,32.88 100.08,32 AVR_DATA_BUF.1
AVR_SNES_WR_EN
  Top 0.203: NAND_GATES.10 83.19,14.22 83.31,14.35 83.31,16 83.19,16.13 80.14,16.13 79.88,16.38 79.88,19.43 77.98,21.34 77.98,31.88 78.36,32.26 79.63,32.26 80.65,31.24 82.81,31.24 IC1.16
AVR_UART_RX  (via drill 0.3)
  Top 0.2: 83.13,35.69 84.66,34.16
  Top 0.203: IC1.9 86.25,34.68 85.73,34.16 84.66,34.16 | 83.13,35.69 76.71,35.69 73.41,38.99 68.07,38.99 66.04,36.96 66.04,28.07 64.39,26.42 v59.69,26.42 | v53.59,26.42 48.01,26.42 45.21,23.62 43.31,23.62 41.78,22.1 41.78,18.29 40.26,16.76 v32.13,16.76 | v12.45,14.99 12.35,15.08 IC3.1
  Bottom 0.203: v53.59,26.42 v59.69,26.42 | v32.13,16.76 29.46,16.76 27.69,14.99 v12.45,14.99
AVR_UART_TX  (via drill 0.3)
  Top 0.2: 83.29,36.2 84.56,34.92
  Top 0.203: IC1.10 85.45,35.03 85.34,34.92 84.56,34.92 | 83.29,36.2 77.22,36.2 73.91,39.5 67.95,39.5 65.53,37.08 65.53,28.45 64.26,27.18 v60.45,27.18 | v51.05,27.18 47.88,27.18 44.83,24.13 42.29,24.13 41.27,23.11 41.27,18.54 40.13,17.4 33.02,17.4 v31.88,18.54 | v12.45,17.65 12.42,17.68 IC3.5
  Bottom 0.203: v51.05,27.18 v60.45,27.18 | v31.88,18.54 30.99,17.65 v12.45,17.65
AVR_WR/  (1 unrouted)
CS/  (via drill 0.3 pad 0.61)
  Top 0.203: SNES_CTRL_BUF.13 v69.09,37.21
  Bottom 0.203: v69.09,37.21 69.34,37.21 69.85,37.72 71.76,37.72 71.76,77.6 71.12,78.23 RAM_CS_DEMUX.4 RAM_CS_DEMUX.5 65.98,76.92 R_CS.2
CS_RAM0  (via drill 0.3)
  Top 0.203: RAM0.22 v5.21,75.69
  Bottom 0.203: RAM_CS_DEMUX.15 5.84,80.77 5.21,80.14 v5.21,75.69
CS_RAM1  (via drill 0.3)
  Top 0.203: RAM1.22 22.48,75.69 v22.73,75.95
  Bottom 0.203: RAM_CS_DEMUX.14 23.11,79.5 22.73,79.12 v22.73,75.95
CS_RAM2  (via drill 0.3)
  Top 0.203: RAM2.22 v40.89,75.69
  Bottom 0.203: RAM_CS_DEMUX.13 41.66,78.23 41.02,77.6 41.02,75.82 v40.89,75.69
CS_RAM3  (via drill 0.3)
  Top 0.203: v54.74,75.69 RAM3.22
  Bottom 0.203: RAM_CS_DEMUX.12 55.12,76.96 54.86,76.71 54.86,75.82 v54.74,75.69
CS_RAM4  (via drill 0.3)
  Top 0.203: RAM4.22 4.19,52.83 v5.21,53.85
  Bottom 0.203: v5.21,53.85 5.21,74.17 7.87,76.83 21.59,76.83 21.84,76.58 21.84,75.31 21.97,75.18 23.5,75.18 23.88,75.56 39.75,75.56 40.39,74.93 41.4,74.93 41.91,75.44 53.85,75.44 54.36,74.93 55.24,74.93 56.01,75.69 RAM_CS_DEMUX.11
CS_RAM5  (via drill 0.3)
  Top 0.2: v10.16,44.7 v13.46,44.7
  Top 0.203: RAM5.22 23.24,52.83 v23.75,53.34
  Bottom 0.2: 8.13,44.7 v10.16,44.7 | 18.35,45.4 17.65,44.7 v13.46,44.7
  Bottom 0.203: RAM_CS_DEMUX.10 54.23,74.42 53.72,74.93 42.29,74.93 41.78,74.42 40.13,74.42 39.5,75.06 24,75.06 23.62,74.68 21.84,74.68 21.34,75.18 21.34,76.33 8,76.33 5.71,74.04 5.71,62.87 6.86,61.72 6.86,61.09 6.6,60.83 6.6,60.2 6.73,60.07 6.73,54.48 6.99,54.23 6.99,53.34 6.73,53.09 6.73,46.1 8.13,44.7 | 18.35,45.4 18.42,45.47 18.42,48.77 19.81,50.16 22.23,50.16 22.48,50.42 22.48,52.96 22.86,53.34 v23.75,53.34
CS_RAM6  (via drill 0.3)
  Top 0.203: RAM6.22 40.13,52.83 v40.89,53.59
  Bottom 0.203: RAM_CS_DEMUX.9 58.55,73.15 58.17,73.53 43.94,73.53 43.43,73.03 43.43,63.37 42.93,62.87 42.04,62.87 41.78,63.12 41.78,65.91 41.4,66.29 34.54,66.29 34.16,65.91 34.16,62.36 37.21,59.31 37.21,56.52 36.7,56.01 33.53,56.01 33.15,56.39 33.15,59.18 32.64,59.69 30.99,59.69 30.61,59.31 30.61,56.26 32.51,54.36 37.85,54.36 38.61,53.59 v40.89,53.59
CS_RAM7  (via drill 0.3)
  Top 0.203: RAM7.22 59.18,52.83 v60.07,53.72
  Bottom 0.203: RAM_CS_DEMUX.7 67.44,74.42 68.71,73.15 68.71,60.71 69.85,59.56 69.85,50.42 66.55,47.12 66.55,45.34 65.91,44.7 60.2,44.7 59.82,45.09 59.82,49.78 60.07,50.04 v60.07,53.72
D0  (via drill 0.3)
  Top 0.203: RAM0.13 18.03,78.23 18.67,78.87 27.05,78.87 27.69,78.23 RAM1.13 35.81,78.23 36.45,78.87 44.83,78.87 45.47,78.23 RAM2.13 53.59,78.23 54.23,78.87 62.99,78.87 63.63,78.23 RAM3.13 77.34,78.23 77.6,78.49 90.81,78.49 93.34,75.95 v95.12,75.95 | RAM4.13 18.03,55.37 18.67,56.01 27.05,56.01 27.69,55.37 RAM5.13 35.94,55.37 36.58,56.01 44.83,56.01 45.47,55.37 RAM6.13 53.72,55.37 54.36,56.01 62.61,56.01 63.25,55.37 RAM7.13 72.52,55.37 73.66,56.52 91.19,56.52 91.69,56.01 v96.14,56.01 | AVR_DATA_BUF.18 97.54,13.97 97.16,13.59 87.25,13.59 v86.87,13.97
  Bottom 0.203: v95.12,75.95 95.12,73.66 92.58,71.12 92.58,63.75 96.14,60.2 v96.14,56.01 96.14,13.97 v86.87,13.97 75.06,13.97 73.53,12.45 60.58,12.45 60.2,12.83 SNES_DATA_BUF.11
D1  (via drill 0.3)
  Top 0.203: RAM0.14 18.03,79.5 18.67,80.14 27.05,80.14 27.69,79.5 RAM1.14 35.81,79.5 36.45,80.14 44.83,80.14 45.47,79.5 RAM2.14 53.59,79.5 54.23,80.14 62.99,80.14 63.63,79.5 RAM3.14 92.46,79.5 93.34,78.61 v94.36,78.61 | RAM4.14 18.03,56.64 18.67,57.28 27.05,57.28 27.69,56.64 RAM5.14 35.94,56.64 36.58,57.28 44.83,57.28 45.47,56.64 RAM6.14 53.72,56.64 54.36,57.28 62.61,57.28 63.25,56.64 RAM7.14 72.01,56.64 72.9,57.53 78.87,57.53 79.63,58.29 92.46,58.29 93.85,56.9 v95.38,56.9 | AVR_DATA_BUF.17 96.27,18.29 v95.38,19.18
  Bottom 0.203: v94.36,78.61 94.36,73.53 92.08,71.25 92.08,63.63 95.38,60.33 v95.38,56.9 v95.38,19.18 95.38,14.73 75.18,14.73 73.41,12.95 62.1,12.95 61.47,13.59 SNES_DATA_BUF.12
D2  (via drill 0.3)
  Top 0.203: RAM0.15 18.03,80.77 18.67,81.41 27.05,81.41 27.69,80.77 RAM1.15 35.81,80.77 36.45,81.41 44.83,81.41 45.47,80.77 RAM2.15 53.59,80.77 54.23,81.41 62.99,81.41 63.63,80.77 RAM3.15 91.44,80.77 91.82,81.15 v94.62,81.15 | RAM4.15 18.03,57.91 18.67,58.55 27.05,58.55 27.69,57.91 RAM5.15 35.94,57.91 36.58,58.55 44.83,58.55 45.47,57.91 RAM6.15 53.72,57.91 54.36,58.55 62.61,58.55 63.25,57.91 RAM7.15 71.5,57.91 72.14,58.55 77.98,58.55 79.63,60.2 93.47,60.2 v94.62,59.05 | AVR_DATA_BUF.16 95,17.53 v94.62,17.91
  Bottom 0.203: v94.62,81.15 94.62,80.26 93.6,79.25 93.6,73.41 91.57,71.37 91.57,63.5 94.62,60.45 v94.62,59.05 v94.62,17.91 94.62,15.49 75.31,15.49 73.28,13.46 63.25,13.46 62.74,13.97 SNES_DATA_BUF.13
D3  (via drill 0.3)
  Top 0.203: RAM0.17 v5.21,82.04 9.27,82.04 9.91,81.41 18.03,81.41 18.67,82.04 RAM1.17 27.05,82.04 27.69,81.41 35.81,81.41 36.45,82.04 RAM2.17 44.83,82.04 45.47,81.41 53.59,81.41 54.23,82.04 RAM3.17 | v91.95,61.09 79.63,61.09 77.6,59.05 71.37,59.05 70.87,58.55 63.25,58.55 62.61,59.18 RAM7.17 54.99,59.18 54.86,59.05 54.23,59.05 53.72,58.55 45.47,58.55 44.83,59.18 RAM6.17 36.58,59.18 35.94,58.55 27.69,58.55 27.05,59.18 RAM5.17 18.67,59.18 18.03,58.55 9.91,58.55 9.4,59.05 8.13,59.05 8,59.18 RAM4.17 v3.17,60.45 | AVR_DATA_BUF.15 93.73,18.92 v93.85,19.05
  Bottom 0.203: v91.95,61.09 92.2,61.09 93.85,59.44 v93.85,19.05 93.85,16.26 75.18,16.26 75.06,16.13 75.06,15.88 73.15,13.97 64.39,13.97 64.01,14.35 SNES_DATA_BUF.14 | v3.17,60.45 3.17,79.88 5.21,81.92 v5.21,82.04
D4  (via drill 0.3)
  Top 0.203: RAM0.18 9.27,80.77 9.91,80.14 18.03,80.14 18.67,80.77 RAM1.18 27.05,80.77 27.69,80.14 35.81,80.14 36.45,80.77 RAM2.18 44.83,80.77 45.47,80.14 53.59,80.14 54.23,80.77 RAM3.18 62.99,80.77 63.63,80.14 v93.09,80.14 | RAM4.18 9.27,57.91 9.91,57.28 18.03,57.28 18.67,57.91 RAM5.18 27.05,57.91 27.69,57.28 35.94,57.28 36.58,57.91 RAM6.18 44.83,57.91 45.47,57.28 53.72,57.28 54.36,57.91 RAM7.18 62.61,57.91 63.25,57.28 71.88,57.28 72.64,58.04 78.36,58.04 79.38,59.05 v93.09,59.05 | v92.46,17.02 AVR_DATA_BUF.14
  Bottom 0.203: v93.09,80.14 93.09,73.53 91.06,71.5 91.06,59.31 91.31,59.05 v93.09,59.05 93.09,17.02 v92.46,17.02 74.8,17.02 74.42,16.64 74.42,15.88 73.03,14.48 65.66,14.48 65.28,14.86 SNES_DATA_BUF.15
D5  (via drill 0.3)
  Top 0.203: RAM0.19 9.27,79.5 9.91,78.87 18.03,78.87 18.67,79.5 RAM1.19 27.05,79.5 27.69,78.87 35.81,78.87 36.45,79.5 RAM2.19 44.83,79.5 45.47,78.87 53.59,78.87 54.23,79.5 RAM3.19 62.99,79.5 63.63,78.87 77.34,78.87 77.47,78.99 91.82,78.99 v92.33,78.49 | RAM4.19 9.27,56.64 9.91,56.01 18.03,56.01 18.67,56.64 RAM5.19 27.05,56.64 27.69,56.01 35.94,56.01 36.58,56.64 RAM6.19 44.83,56.64 45.47,56.01 53.72,56.01 54.36,56.64 RAM7.19 62.61,56.64 63.25,56.01 72.26,56.01 73.28,57.02 92.08,57.02 v92.33,57.28 | v91.19,17.78 AVR_DATA_BUF.13
  Bottom 0.203: v92.33,78.49 92.33,73.41 90.55,71.63 90.55,57.91 91.19,57.28 v92.33,57.28 92.33,17.78 v91.19,17.78 74.04,17.78 73.79,17.53 73.79,15.88 72.9,14.99 66.68,14.99 66.55,15.11 SNES_DATA_BUF.16
D6  (via drill 0.3)
  Top 0.203: RAM0.20 9.27,78.23 9.91,77.6 18.03,77.6 18.67,78.23 RAM1.20 27.05,78.23 27.69,77.6 35.81,77.6 36.45,78.23 RAM2.20 44.83,78.23 45.47,77.6 53.59,77.6 54.23,78.23 RAM3.20 62.99,78.23 63.63,77.6 77.34,77.6 77.72,77.98 90.3,77.98 91.57,76.71 v91.57,75.95 | RAM4.20 9.27,55.37 9.91,54.74 18.03,54.74 18.67,55.37 RAM5.20 27.05,55.37 27.69,54.74 35.94,54.74 36.58,55.37 RAM6.20 39.5,55.37 39.62,55.5 44.7,55.5 45.47,54.74 53.72,54.74 54.36,55.37 RAM7.20 57.66,55.37 57.78,55.5 62.48,55.5 63.25,54.74 72.9,54.74 74.17,56.01 90.3,56.01 91.19,55.12 v91.57,55.12 | v89.92,18.54 AVR_DATA_BUF.12
  Bottom 0.203: v91.57,75.95 91.57,73.28 90.04,71.75 90.04,57.4 91.57,55.88 v91.57,55.12 91.57,18.54 v89.92,18.54 73.79,18.54 73.15,17.91 73.15,15.88 72.77,15.49 68.07,15.49 67.82,15.75 SNES_DATA_BUF.17
D7  (via drill 0.3)
  Top 0.203: RAM0.21 9.27,76.96 9.91,76.33 18.03,76.33 18.67,76.96 RAM1.21 22.1,76.96 22.35,77.22 26.8,77.22 27.69,76.33 35.81,76.33 36.45,76.96 RAM2.21 44.83,76.96 45.47,76.33 53.59,76.33 54.23,76.96 RAM3.21 62.99,76.96 63.63,76.33 70.74,76.33 | RAM4.21 3.81,54.1 4.45,54.74 8.64,54.74 9.91,53.47 18.03,53.47 18.67,54.1 RAM5.21 22.23,54.1 22.48,54.36 26.8,54.36 27.69,53.47 35.94,53.47 36.58,54.1 RAM6.21 39.88,54.1 40.26,54.48 44.45,54.48 45.47,53.47 53.72,53.47 54.36,54.1 RAM7.21 57.91,54.1 58.29,54.48 62.23,54.48 63.25,53.47 71.76,53.47 71.88,53.59 73.91,53.59 74.93,54.61 89.15,54.61 90.04,53.72 v90.81,53.72 | 70.74,76.33 70.99,76.33 | 70.74,76.33 77.6,76.33 77.85,76.58 82.17,76.58 82.3,76.71 89.15,76.71 v90.81,75.06 | v88.65,19.3 AVR_DATA_BUF.11
  Bottom 0.203: v90.81,75.06 90.81,73.15 89.54,71.88 89.54,56.9 90.81,55.63 v90.81,53.72 90.81,19.3 v88.65,19.3 87.76,19.3 87.5,19.05 80.77,19.05 80.52,19.3 72.26,19.3 71.76,19.68 69.22,19.68 69.09,19.56 SNES_DATA_BUF.18
GND  (via drill 0.3, 0.3 pad 0.61)  (1 unrouted)
  Top 0.203: RAM0.16 17.91,82.04 18.54,82.68 27.05,82.68 27.69,82.04 RAM1.16 35.81,82.04 36.45,82.68 44.83,82.68 45.47,82.04 RAM2.16 53.59,82.04 54.23,82.68 62.61,82.68 63.25,82.04 RAM3.16 | RAM5.16 35.94,59.18 36.58,59.82 44.83,59.82 45.47,59.18 RAM6.16 53.72,59.18 v54.36,59.94 62.61,59.82 63.25,59.18 RAM7.16 | RAM4.16 18.03,59.18 | v24.26,6.48 U$2.36 | v24.26,12.7 30.73,12.7 31.12,12.32 SNES_ADDR_BUF1.10 | v32.13,10.79 32.13,10.92 | v13.59,73.15 13.46,73.15 | v78.99,31.5 79.12,31.37 | C_FTDI_3.3.1 10.67,25.78 11.18,26.29 11.18,30.73 10.67,31.24 8.77,31.24 X3.5 | v58.55,6.73 58.55,6.98 | v45.72,10.16 45.72,10.29
  Bottom 0.2: C_FTDI_3.4.1 32.2,14.79 33.15,13.84 33.15,12.7 | C_FTDI_3.1.1 67.18,64.64 v65.91,63.37 | C_FTDI_3.2.1 3.43,52.32 3.81,51.94 5.94,51.94 AVR_ADDR_CNT0.8 | AVR_ADDR_SREG1.13 38.61,72.14 38.35,72.39 36.83,72.39 36.7,72.26 36.7,69.22 36.32,68.83 25.65,68.83 21.72,72.77 21.21,72.77 20.7,73.28 17.65,73.28 17.27,72.9 | AVR_ADDR_BUF0.10 21.59,44.83 20.57,43.81 12.45,43.81 11.94,44.32 11.94,45.21 12.32,45.59 15.75,45.59 15.87,45.72 15.87,51.56 16,51.69 16.66,51.69 AVR_ADDR_CNT1.8
  Bottom 0.203: 33.15,12.7 SNES_ADDR_BUFHIROM.10 32.16,10.77 v32.13,10.79 | U$2.36 v24.26,6.48 23.75,7.11 23.75,12.19 v24.26,12.7 | AVR_ADDR_SREG0.13 17.27,72.9 17.02,73.15 v13.59,73.15 | v78.99,37.97 v78.99,34.29 v78.99,31.5 | v52.45,36.58 v60.07,36.58 | v88.14,29.46 v88.14,32.38 | SNES_DATA_BUF.10 60.2,9.27 60.45,9.02 60.45,8.64 v58.55,6.73 | SNES_ADDR_BUFLOROM.10 46.74,10.16 v45.72,10.16 | AVR_ADDR_BUF0.10 26.7,47.27 27.43,48.01 AVR_ADDR_CNT2.8 | AVR_ADDR_CNT4.8 48.77,48.26 47.78,47.27 AVR_ADDR_BUF1.10 42.93,45.72 43.18,45.47 | AVR_ADDR_SREG2.8 54.86,63.37 54.99,63.25 54.99,62.61 54.86,62.48 54.86,60.45 v54.36,59.94 | AVR_ADDR_SREG2.13 59.94,71.88 60.32,72.26 61.34,72.26 62.23,73.15 RAM_CS_DEMUX.8 65.94,63.4 v65.91,63.37 | v12.19,62.61 AVR_ADDR_SREG0.8 | AVR_ADDR_CNT3.8 38.1,49.78 37.21,48.9 37.21,45.72 37.46,45.47 43.18,45.47 | AVR_ADDR_SREG1.8 33.53,61.85 v35.69,59.69 | 43.18,45.47 49.66,45.47 50.55,44.58 57.4,44.58 58.42,43.56 66.17,43.56 67.06,42.67 v67.06,40.77 | AVR_ADDR_CNT5.8 59.44,53.09 59.05,53.47 59.05,54.23 59.31,54.48 60.83,54.48 61.34,53.98 61.34,50.04 61.09,49.78 61.09,46.1 61.72,45.47 64.01,45.47 64.26,45.72 | 64.26,45.72 AVR_ADDR_BUF2.10 | 64.26,45.72 64.52,45.47 65.53,45.47 66.04,45.97 66.04,47.24 69.34,50.55 69.34,59.44 v67.69,61.09 | AVR_ADDR_CNT0.8 6.1,53.47 v6.22,53.59
  pour Top: -0.13,8.51 -0.13,84.96 102.74,84.96 102.74,8.26 82.04,8.26 82.04,-0.13 21.72,-0.13 21.72,8.51
HI/LOROM_SW  (via drill 0.3)
  Top 0.203: NAND_GATES.4 NAND_GATES.5 | NAND_GATES.4 76.84,15.49 77.34,16 77.34,32.26 77.85,32.77 80.39,32.77 81.08,32.08 IC1.15 | NAND_GATES.4 73.53,15.49 72.77,14.73 59.82,14.73 59.31,15.24 59.31,19.3 v59.18,19.43
  Bottom 0.2: 44.07,19.56 44.58,20.07 47.37,20.07 47.62,19.81 48.89,19.81 49.4,20.32 51.69,20.32 52.2,19.81 54.74,19.81
  Bottom 0.203: v59.18,19.43 58.67,19.43 58.42,19.18 55.37,19.18 54.74,19.81 | 44.07,19.56 43.31,18.8 SNES_ADDR_BUFHIROM.19
HI/LOROM_SW_INV  (via drill 0.3)
  Top 0.203: NAND_GATES.6 74.17,12.95 72.9,14.22 v56.9,14.22
  Bottom 0.203: v56.9,14.22 SNES_ADDR_BUFLOROM.19
ISP_/SS
  Top 0.203: IC1.44 94.45,35.01 97.16,37.72 SV1.6
ISP_MISO
  Top 0.203: IC1.2 91.85,37.36 91.95,37.47 95.38,37.47 96.27,38.35 96.27,42.42 96.65,42.8 SV1.4
ISP_MOSI
  Top 0.203: IC1.1 94.95,36.28 96.77,38.1 96.77,40.01 97.03,40.26 SV1.5
ISP_RST
  Top 0.203: IC1.4 90.25,37.67 91.06,38.48 95,38.48 95.25,38.73 95.25,47.24 95.89,47.88 | 95.89,47.88 SV1.2 | R_RST.1 97.03,52.96 95.89,51.82 95.89,47.88
ISP_SCK
  Top 0.203: IC1.3 91.05,37.83 91.19,37.97 95.12,37.97 95.76,38.61 95.76,45.09 96.01,45.34 SV1.3
LED
  Top 0.203: LED1.A 79.86,24.57 R_LED1.1 82.11,24.64 83.44,24.64 83.69,24.38 83.69,23.5 84.07,23.11 86.87,23.11 87.05,23.29 IC1.26
N$1
  Bottom 0.203: AVR_ADDR_CNT0.7 7.37,49.91 8.51,48.77 11.3,48.77 11.43,48.64 AVR_ADDR_BUF0.2
N$2
  Bottom 0.203: AVR_ADDR_CNT2.3 33.78,50.29 35.31,48.77 AVR_ADDR_BUF1.4
N$3
  Bottom 0.203: AVR_ADDR_CNT0.2 13.72,50.04 15.24,48.51 AVR_ADDR_BUF0.5
N$4
  Bottom 0.203: AVR_ADDR_CNT0.3 12.45,50.29 13.97,48.77 AVR_ADDR_BUF0.4
N$5
  Bottom 0.203: AVR_ADDR_CNT1.7 18.03,50.29 17.78,50.04 16.89,50.04 16.51,49.66 AVR_ADDR_BUF0.6
N$6
  Bottom 0.203: AVR_ADDR_CNT1.6 19.3,50.67 17.78,49.15 AVR_ADDR_BUF0.7
N$7
  Bottom 0.203: AVR_ADDR_BUF0.9 20.32,48.51 20.96,49.15 23.11,49.15 24.38,50.42 AVR_ADDR_CNT1.2
N$8
  Bottom 0.203: AVR_ADDR_BUF0.8 19.05,48.64 20.07,49.66 22.48,49.66 23.11,50.29 AVR_ADDR_CNT1.3
N$9
  Bottom 0.203: AVR_ADDR_CNT0.12 9.91,54.86 10.41,54.36 19.3,54.36 20.57,53.09 AVR_ADDR_CNT1.5
N$10
  Bottom 0.203: AVR_ADDR_CNT0.13 11.18,55.12 11.43,54.86 20.57,54.86 21.84,53.59 AVR_ADDR_CNT1.4
N$11
  Bottom 0.203: AVR_ADDR_SREG1.14 39.88,72.64 38.35,74.17 21.72,74.17 20.83,75.06 11.43,75.06 10.92,74.55 10.92,71.25 11.3,70.87 12.17,70.87 AVR_ADDR_SREG0.9
N$12
  Bottom 0.203: AVR_ADDR_SREG0.15 19.81,67.69 18.92,66.8 11.81,66.8 11.18,66.17 11.18,61.85 13.72,59.31 AVR_ADDR_CNT0.15
N$13
  Bottom 0.203: AVR_ADDR_SREG0.1 21.08,68.83 20.45,69.47 20.45,72.14 20.32,72.26 19.3,72.26 19.18,72.14 19.18,69.47 18.67,68.96 13.33,68.96 10.54,66.17 10.54,60.58 9.27,59.31 9.27,54.23 9.65,53.85 14.22,53.85 14.99,53.09 AVR_ADDR_CNT0.1
N$14  (via drill 0.3)
  Top 0.203: v7.37,60.58 18.92,60.58 v19.56,61.21
  Bottom 0.203: v19.56,61.21 19.81,61.47 19.81,61.72 AVR_ADDR_SREG0.2 | AVR_ADDR_CNT0.10 v7.37,60.58
N$15  (via drill 0.3)
  Top 0.203: v6.1,61.34 v18.54,61.34
  Bottom 0.203: v18.54,61.34 AVR_ADDR_SREG0.3 | AVR_ADDR_CNT0.9 v6.1,61.34
N$16
  Bottom 0.203: AVR_ADDR_SREG0.4 17.27,61.47 18.29,60.45 20.07,60.45 20.83,61.21 23.88,61.21 24.38,60.71 AVR_ADDR_CNT1.15
N$17
  Bottom 0.203: AVR_ADDR_SREG0.5 16,61.98 18.67,59.31 18.67,55.63 18.92,55.37 20.83,55.37 22.1,54.1 24.89,54.1 25.65,53.34 AVR_ADDR_CNT1.1
N$18
  Bottom 0.203: AVR_ADDR_SREG0.6 14.73,62.36 18.03,59.05 AVR_ADDR_CNT1.10
N$19
  Bottom 0.203: AVR_ADDR_SREG0.7 13.46,62.36 16.76,59.05 AVR_ADDR_CNT1.9
N$20
  Bottom 0.203: AVR_ADDR_SREG1.7 34.8,62.48 38.1,59.18 AVR_ADDR_CNT3.9
N$21
  Bottom 0.203: AVR_ADDR_SREG1.1 42.42,68.83 41.78,69.47 41.78,72.26 41.53,72.52 40.77,72.52 40.51,72.26 40.51,69.47 38.35,67.31 33.15,67.31 30.86,65.02 30.86,61.09 30.48,60.71 29.72,60.71 29.21,60.2 29.21,59.31 29.34,59.18 29.34,56.13 29.97,55.5 30.73,55.5 32.38,53.85 35.69,53.85 36.32,53.21 AVR_ADDR_CNT2.1
N$22  (via drill 0.3)
  Top 0.203: v28.7,61.09 38.86,61.09 39.37,60.58 v41.15,60.58
  Bottom 0.203: AVR_ADDR_CNT2.10 v28.7,61.09 | v41.15,60.58 AVR_ADDR_SREG1.2
N$23  (via drill 0.3)
  Top 0.203: v27.43,61.59 27.81,61.59 28.07,61.85 38.99,61.85 39.5,61.34 v39.88,61.34
  Bottom 0.203: AVR_ADDR_CNT2.9 v27.43,61.59 | v39.88,61.34 AVR_ADDR_SREG1.3
N$24
  Bottom 0.203: AVR_ADDR_CNT1.12 20.57,56.39 22.35,54.61 26.67,54.61 27.81,53.47 30.73,53.47 31.24,52.96 AVR_ADDR_CNT2.5
N$25
  Bottom 0.203: AVR_ADDR_CNT1.13 21.84,55.88 22.61,55.12 26.92,55.12 28.07,53.98 31.5,53.98 32.51,52.96 AVR_ADDR_CNT2.4
N$26
  Bottom 0.203: AVR_ADDR_CNT2.2 35.05,50.29 36.58,48.77 AVR_ADDR_BUF1.5
N$27
  Bottom 0.203: AVR_ADDR_CNT2.6 29.97,49.78 30.23,49.53 33.15,49.53 34.04,48.64 AVR_ADDR_BUF1.3
N$28
  Bottom 0.203: AVR_ADDR_CNT2.7 28.7,49.53 29.34,48.9 32.38,48.9 32.77,48.51 AVR_ADDR_BUF1.2
N$29
  Bottom 0.203: AVR_ADDR_CNT4.3 55.12,50.04 56.64,48.51 AVR_ADDR_BUF2.4
N$30
  Bottom 0.203: AVR_ADDR_SREG1.4 38.61,61.47 40.26,59.82 45.21,59.82 45.72,59.31 AVR_ADDR_CNT3.15
N$31
  Bottom 0.203: AVR_ADDR_SREG1.5 37.34,61.85 40,59.18 40,56.39 40.51,55.88 41.53,55.88 43.69,53.72 46.48,53.72 46.99,53.21 AVR_ADDR_CNT3.1
N$32
  Bottom 0.203: AVR_ADDR_SREG1.6 36.07,62.48 39.37,59.18 AVR_ADDR_CNT3.10
N$33
  Bottom 0.203: AVR_ADDR_BUF1.8 40.39,48.9 41.02,49.53 44.07,49.53 44.45,49.91 AVR_ADDR_CNT3.3
N$34
  Bottom 0.203: AVR_ADDR_BUF1.9 41.66,48.64 41.91,48.9 44.7,48.9 45.72,49.91 AVR_ADDR_CNT3.2
N$35
  Bottom 0.203: AVR_ADDR_BUF1.7 39.12,48.77 40.64,50.29 AVR_ADDR_CNT3.6
N$36
  Bottom 0.203: AVR_ADDR_CNT3.7 39.37,50.29 37.85,48.77 AVR_ADDR_BUF1.6
N$37